# Altium schematic sheet TS-4900 Headers.SchDoc: Yonder Parent TS-4900 Version
size Letter; DrawnBy: MTAN; Organization: Altium Limited; DocumentNumber: 4; Revision: D; SheetNumber: 4; SheetTotal: 5
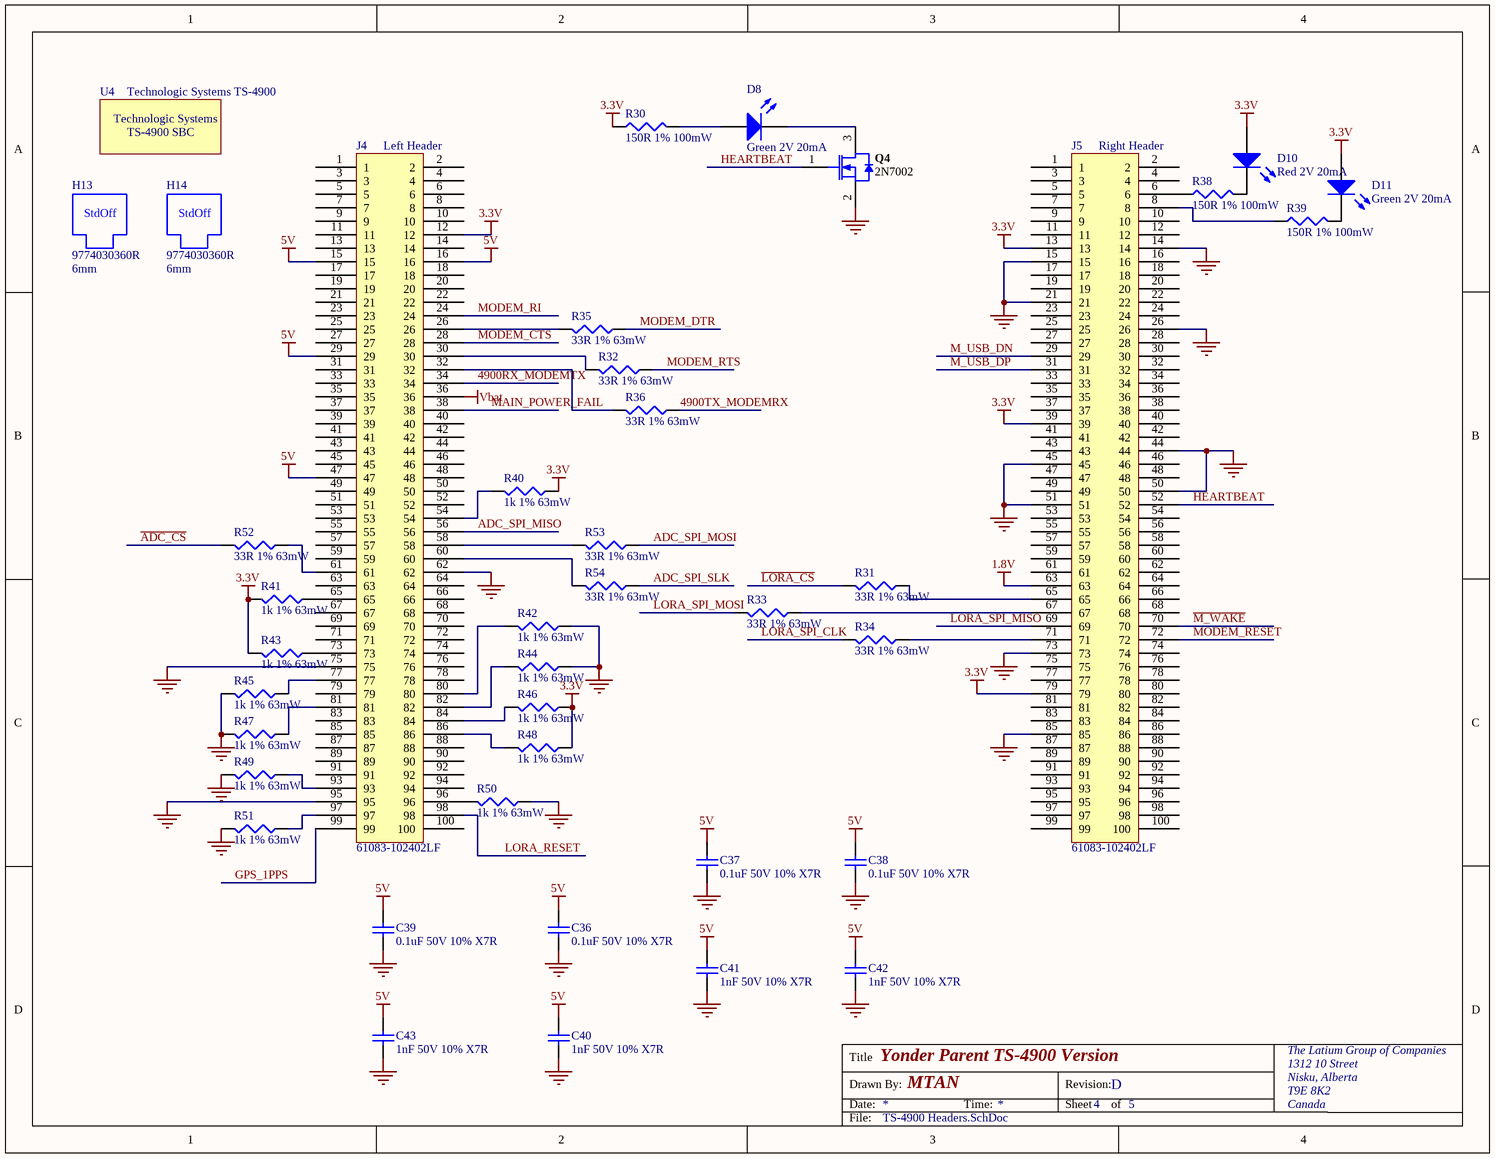
[diagram p0: TS-4900 Headers.SchDoc]

## Parts
C36  0.1uF 50V 10% X7R  [CAPC1005L]
C37  0.1uF 50V 10% X7R  [CAPC1005L]
C38  0.1uF 50V 10% X7R  [CAPC1005L]
C39  0.1uF 50V 10% X7R  [CAPC1005L]
C40  1nF 50V 10% X7R  [CAPC1005L]
C41  1nF 50V 10% X7R  [CAPC1005L]
C42  1nF 50V 10% X7R  [CAPC1005L]
C43  1nF 50V 10% X7R  [CAPC1005L]
D8  Green 2V 20mA  [CD1608-0603]
D10  Red 2V 20mA  [CD1608-0603]
D11  Green 2V 20mA  [CD1608-0603]
H13  9774030360R  Height: 6mm  [Wurth 9774060360R]
H14  9774030360R  Height: 6mm  [Wurth 9774060360R]
J4  61083-102402LF  Note: Left Header  [TS 100 Pin Header]
J5  61083-102402LF  Note: Right Header  [TS 100 Pin Header]
Q4  2N7002  [INF-PG-SOT23_L]
R30  150R 1% 100mW  [RESC1608L]
R31  33R 1% 63mW  [RESC1005L]
R32  33R 1% 63mW  [RESC1005L]
R33  33R 1% 63mW  [RESC1005L]
R34  33R 1% 63mW  [RESC1005L]
R35  33R 1% 63mW  [RESC1005L]
R36  33R 1% 63mW  [RESC1005L]
R38  150R 1% 100mW  [RESC1608L]
R39  150R 1% 100mW  [RESC1608L]
R40  1k 1% 63mW  [RESC1005L]
R41  1k 1% 63mW  [RESC1005L]
R42  1k 1% 63mW  [RESC1005L]
R43  1k 1% 63mW  [RESC1005L]
R44  1k 1% 63mW  [RESC1005L]
R45  1k 1% 63mW  [RESC1005L]
R46  1k 1% 63mW  [RESC1005L]
R47  1k 1% 63mW  [RESC1005L]
R48  1k 1% 63mW  [RESC1005L]
R49  1k 1% 63mW  [RESC1005L]
R50  1k 1% 63mW  [RESC1005L]
R51  1k 1% 63mW  [RESC1005L]
R52  33R 1% 63mW  [RESC1005L]
R53  33R 1% 63mW  [RESC1005L]
R54  33R 1% 63mW  [RESC1005L]
U4  Technologic Systems TS-4900  [TS-4900]

## Nets
1.8V: J5.63
3.3V: D10.1(A) D11.1(A) J4.12 J5.13 J5.39 J5.79 R30.1 R40.1 R41.2 R43.2 R46.1 R48.1
5V: C36.1 C37.1 C38.1 C39.1 C40.1 C41.1 C42.1 C43.1 J4.15 J4.16 J4.29 J4.47
GND: C36.2 C37.2 C38.2 C39.2 C40.2 C41.2 C42.2 C43.2 J4.62 J4.75 J4.95 J5.14 J5.15 J5.21 J5.26 J5.44 J5.45 J5.50 J5.51 J5.73 J5.85 Q4.2(SOURCE) R42.1 R44.1 R45.2 R47.2 R49.2 R50.1 R51.2
Vbat: J4.36
4900RX_MODEMTX: J4.34
4900TX_MODEMRX: R36.1
~{ADC_CS}: R52.2
ADC_SPI_MISO: J4.56
ADC_SPI_MOSI: R53.1
ADC_SPI_SLK: R54.1
GPS_1PPS: J4.99
HEARTBEAT: J5.52 Q4.1(GATE)
~{LORA_CS}: R31.2
LORA_RESET: J4.98
LORA_SPI_CLK: R34.2
LORA_SPI_MISO: J5.69
LORA_SPI_MOSI: R33.2
~{M_WAKE}: J5.70
M_USB_DN: J5.29
M_USB_DP: J5.31
MAIN_POWER_FAIL: J4.38
MODEM_CTS: J4.28
MODEM_DTR: R35.1
MODEM_RESET: J5.72
MODEM_RI: J4.24
MODEM_RTS: R32.1
NetD8_1: D8.1(A) R30.2
NetD8_2: D8.2(K) Q4.3(DRAIN)
NetD10_2: D10.2(K) R38.2
NetD11_2: D11.2(K) R39.2
NetJ4_26: J4.26 R35.2
NetJ4_30: J4.30 R32.2
NetJ4_32: J4.32 R36.2
NetJ4_54: J4.54 R40.2
NetJ4_58: J4.58 R53.2
NetJ4_60: J4.60 R54.2
NetJ4_61: J4.61 R52.1
NetJ4_65: J4.65 R41.1
NetJ4_73: J4.73 R43.1
NetJ4_77: J4.77 R45.1
NetJ4_80: J4.80 R42.2
NetJ4_81: J4.81 R47.1
NetJ4_82: J4.82 R44.2
NetJ4_84: J4.84 R46.2
NetJ4_86: J4.86 R48.2
NetJ4_93: J4.93 R49.1
NetJ4_96: J4.96 R50.2
NetJ4_97: J4.97 R51.1
NetJ5_6: J5.6 R38.1
NetJ5_8: J5.8 R39.1
NetJ5_65: J5.65 R31.1
NetJ5_67: J5.67 R33.1
NetJ5_71: J5.71 R34.1

Not connected (* = marked no-connect by the designer): J4 1 2 3 4 5 6 7 8 9 10 11 13 14 17 18 19 20 21 22 23 25 27 31 33 35 37 39 40 41 42 43 44 45 46 48 49 50 51 52 53 55 57 59 63 64 66 67 68 69 70 71 72 74 76 78 79 83 85 87 88 89 90 91 92 94 100; J5 1 2 3 4 5 7 9 10 11 12 16 17 18 19 20 22 23 24 25 27 28 30 32 33 34 35 36 37 38 40 41 42 43 46 47 48 49 53 54 55 56 57 58 59 60 61 62 64 66 68 74 75 76 77 78 80 81 82 83 84 86 87 88 89 90 91 92 93 94 95 96 97 98 99 100

## Notes on the sheet
- Title
- Drawn By:
- Date:
- Time:
- Revision:
- Sheet
- of
- The Latium Group of Companies
- 1312 10 Street
- Nisku, Alberta
- T9E 8K2
- Canada
- File:
- (in symbol SMD M3 Spacer) StdOff
- (in symbol TS-4900) Technologic Systems; TS-4900 SBC

## Library data of the parts
C36-C43 = Cap: Capacitor
  C36-C39: Value: 0.1uF 50V 10% X7R
  C40-C43: Value: 1nF 50V 10% X7R
D8 D11 = LED2: LED GREEN CLEAR 0603 SMD; Manufacturer: Wurth Electronics Inc; Manufacturer Part Number: 150060VS75000; Value: Green 2V 20mA; Supplier 1: Digi-Key; Supplier 1 Part Number: 732-4980-1-ND
D10 = LED2: LED RED CLEAR 0603 SMD; Manufacturer: Wurth Electronics Inc; Manufacturer Part Number: 150060RS75000; Value: Red 2V 20mA; Supplier 1: Digi-Key; Supplier 1 Part Number: 732-4978-1-ND
H13 H14 = SMD M3 Spacer: ROUND STANDOFF M3X0.5 STEEL 6MM; Manufacturer: Wurth Electronics Inc; Manufacturer Part Number: 9774060360R; Supplier 1: Digi-Key; Value: 9774030360R; ComponentLink1Description: Drawing; ComponentLink1URL: S:\Hardware\Data Sheets\Passive\Spacers\Wurth 9774060360R.pdf; Supplier 1 Part Number: 732-5273-1-ND
J4 J5 = Header 50 x 2: CONN PLUG 100POS SMD GOLD; Manufacturer: Amphenol ICC (FCI); Value: 61083-102402LF; Manufacturer Part Number: 61083-102402LF; Supplier 1: Digi-Key; Supplier 1 Part Number: 609-1693-1-ND; ComponentLink1Description: Drawing 1; ComponentLink1URL: S:\Hardware\Data Sheets\Passive\Connectors\61083.pdf; ComponentLink2URL: S:\Hardware\Data Sheets\Passive\Connectors\cn-tssocket-m-spec.pdf; ComponentLink2Description: Drawing 2
Q4 = 2N7002: MOSFET N-CH 60V 115MA SOT-23; Manufacturer: ON Semiconductor; PartNumber: 2N7002; ComponentLink1Description: Data Sheet; ComponentLink1URL: S:\Hardware\Data Sheets\Active\Transistors\FETs\NDS7002A-D.pdf; Manufacturer Part Number: 2N7002; Value: 2N7002; Supplier 1: Digi-Key; Supplier 1 Part Number: 2N7002NCT-ND
R30-R36 R38-R54 = Res3: Resistor
  R30 R38 R39: Value: 150R 1% 100mW
  R31-R36 R52-R54: Value: 33R 1% 63mW
  R40-R51: Value: 1k 1% 63mW
U4 = TS-4900: Value: Technologic Systems TS-4900